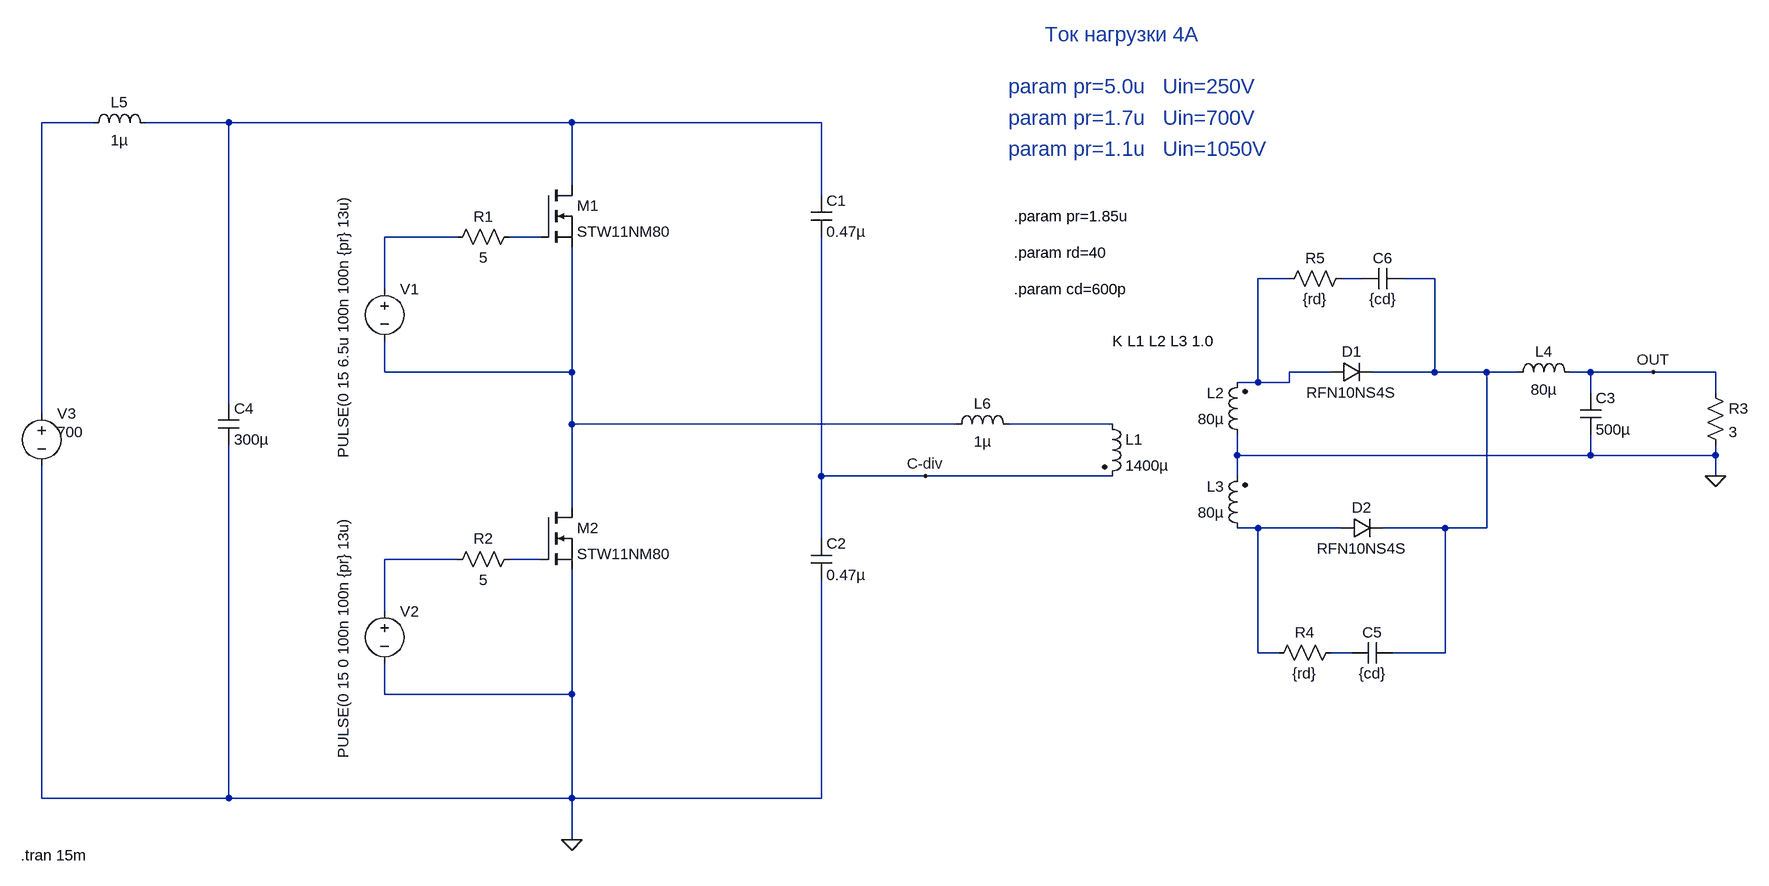
[diagram p0: schematic H-bridge-with-Inductor-and-dempfer.asc]
H-bridge-with-Inductor-and-dempfer.asc, the LTspice schematic file:
Version 4
SHEET 1 2120 1096
WIRE -432 -48 -512 -48
WIRE -224 -48 -352 -48
WIRE 304 -48 -224 -48
WIRE 688 -48 304 -48
WIRE 304 48 304 -48
WIRE 688 64 688 -48
WIRE 128 128 16 128
WIRE 256 128 208 128
WIRE 1408 192 1360 192
WIRE 1520 192 1488 192
WIRE 1632 192 1584 192
WIRE 16 208 16 128
WIRE 16 336 16 288
WIRE 304 336 304 144
WIRE 304 336 16 336
WIRE 1472 336 1408 336
WIRE 1632 336 1632 192
WIRE 1632 336 1536 336
WIRE 1712 336 1632 336
WIRE 1760 336 1712 336
WIRE 1872 336 1840 336
WIRE 1968 336 1872 336
WIRE 2064 336 1968 336
WIRE 1360 352 1360 192
WIRE 1360 352 1328 352
WIRE 1408 352 1408 336
WIRE 1408 352 1360 352
WIRE 1872 368 1872 336
WIRE 2064 368 2064 336
WIRE -224 384 -224 -48
WIRE -512 400 -512 -48
WIRE 304 416 304 336
WIRE 896 416 304 416
WIRE 1136 416 976 416
WIRE 1328 464 1328 432
WIRE 1872 464 1872 432
WIRE 1872 464 1328 464
WIRE 2064 464 2064 448
WIRE 2064 464 1872 464
WIRE 688 496 688 128
WIRE 848 496 688 496
WIRE 1136 496 848 496
WIRE 1328 496 1328 464
WIRE 2064 496 2064 464
WIRE 304 544 304 416
WIRE 1360 576 1328 576
WIRE 1488 576 1360 576
WIRE 1648 576 1552 576
WIRE 1712 576 1712 336
WIRE 1712 576 1648 576
WIRE 688 592 688 496
WIRE 128 624 16 624
WIRE 256 624 208 624
WIRE 16 704 16 624
WIRE 1360 768 1360 576
WIRE 1392 768 1360 768
WIRE 1504 768 1472 768
WIRE 1648 768 1648 576
WIRE 1648 768 1568 768
WIRE 16 832 16 784
WIRE 304 832 304 640
WIRE 304 832 16 832
WIRE -512 992 -512 480
WIRE -224 992 -224 448
WIRE -224 992 -512 992
WIRE 304 992 304 832
WIRE 304 992 -224 992
WIRE 688 992 688 656
WIRE 688 992 304 992
WIRE 304 1056 304 992
FLAG 304 1056 0
FLAG 2064 496 0
FLAG 1968 336 OUT
FLAG 848 496 C-div
SYMBOL nmos 256 48 R0
SYMATTR InstName M1
SYMATTR Value STW11NM80
SYMBOL nmos 256 544 R0
SYMATTR InstName M2
SYMATTR Value STW11NM80
SYMBOL voltage 16 192 R0
WINDOW 3 -64 -133 VRight 2
WINDOW 123 0 0 Left 0
WINDOW 39 0 0 Left 0
SYMATTR Value PULSE(0 15 6.5u 100n 100n {pr} 13u)
SYMATTR InstName V1
SYMBOL res 224 112 R90
WINDOW 0 0 56 VBottom 2
WINDOW 3 32 56 VTop 2
SYMATTR InstName R1
SYMATTR Value 5
SYMBOL res 224 608 R90
WINDOW 0 0 56 VBottom 2
WINDOW 3 32 56 VTop 2
SYMATTR InstName R2
SYMATTR Value 5
SYMBOL voltage 16 688 R0
WINDOW 3 -64 -133 VRight 2
WINDOW 123 0 0 Left 0
WINDOW 39 0 0 Left 0
SYMATTR Value PULSE(0 15 0 100n 100n {pr} 13u)
SYMATTR InstName V2
SYMBOL cap 672 64 R0
SYMATTR InstName C1
SYMATTR Value 0.47µ
SYMBOL voltage -512 384 R0
WINDOW 3 24 44 Left 2
WINDOW 123 0 0 Left 0
WINDOW 39 0 0 Left 0
SYMATTR Value 700
SYMATTR InstName V3
SYMBOL cap 672 592 R0
SYMATTR InstName C2
SYMATTR Value 0.47µ
SYMBOL ind2 1120 400 R0
SYMATTR InstName L1
SYMATTR Value 1400µ
SYMATTR Type ind
SYMBOL ind2 1344 448 R180
WINDOW 0 36 80 Left 2
WINDOW 3 36 40 Left 2
SYMATTR InstName L2
SYMATTR Value 80µ
SYMATTR Type ind
SYMBOL ind2 1344 592 R180
WINDOW 0 36 80 Left 2
WINDOW 3 36 40 Left 2
SYMATTR InstName L3
SYMATTR Value 80µ
SYMATTR Type ind
SYMBOL res 2048 352 R0
SYMATTR InstName R3
SYMATTR Value 3
SYMBOL ind 1744 352 R270
WINDOW 0 32 56 VTop 2
WINDOW 3 5 56 VBottom 2
SYMATTR InstName L4
SYMATTR Value 80µ
SYMBOL cap 1856 368 R0
SYMATTR InstName C3
SYMATTR Value 500µ
SYMBOL ind -448 -32 R270
WINDOW 0 32 56 VTop 2
WINDOW 3 5 56 VBottom 2
SYMATTR InstName L5
SYMATTR Value 1µ
SYMBOL cap -240 384 R0
SYMATTR InstName C4
SYMATTR Value 300µ
SYMBOL diode 1488 592 R270
WINDOW 0 32 32 VTop 2
WINDOW 3 0 32 VBottom 2
SYMATTR InstName D2
SYMATTR Value RFN10NS4S
SYMBOL diode 1472 352 R270
WINDOW 0 32 32 VTop 2
WINDOW 3 0 32 VBottom 2
SYMATTR InstName D1
SYMATTR Value RFN10NS4S
SYMBOL res 1488 752 R90
WINDOW 0 0 56 VBottom 2
WINDOW 3 32 56 VTop 2
SYMATTR InstName R4
SYMATTR Value {rd}
SYMBOL cap 1568 752 R90
WINDOW 0 0 32 VBottom 2
WINDOW 3 32 32 VTop 2
SYMATTR InstName C5
SYMATTR Value {cd}
SYMBOL res 1504 176 R90
WINDOW 0 0 56 VBottom 2
WINDOW 3 32 56 VTop 2
SYMATTR InstName R5
SYMATTR Value {rd}
SYMBOL cap 1584 176 R90
WINDOW 0 0 32 VBottom 2
WINDOW 3 32 32 VTop 2
SYMATTR InstName C6
SYMATTR Value {cd}
SYMBOL ind 880 432 R270
WINDOW 0 32 56 VTop 2
WINDOW 3 5 56 VBottom 2
SYMATTR InstName L6
SYMATTR Value 1µ
TEXT 1136 288 Left 2 !K L1 L2 L3 1.0
TEXT -544 1080 Left 2 !.tran 15m
TEXT 984 96 Left 2 !.param pr=1.85u
TEXT 976 -56 Left 3 ;param pr=1.7u   Uin=700V
TEXT 976 -8 Left 3 ;param pr=1.1u   Uin=1050V
TEXT 976 -104 Left 3 ;param pr=5.0u   Uin=250V
TEXT 1032 -184 Left 3 ;Ток нагрузки 4А
TEXT 984 152 Left 2 !.param rd=40
TEXT 984 208 Left 2 !.param cd=600p

The netlist it stands for:
* H-bridge-with-Inductor-and-dempfer.asc
M1 N002 N004 N008 N008 STW11NM80
M2 N008 N012 0 0 STW11NM80
V1 N003 N008 PULSE(0 15 6.5u 100n 100n {pr} 13u)
R1 N004 N003 5
R2 N012 N011 5
V2 N011 0 PULSE(0 15 0 100n 100n {pr} 13u)
C1 N002 C-div 0.47µ
V3 N001 0 700
C2 C-div 0 0.47µ
L1 N009 C-div 1400µ
L2 0 N005 80µ
L3 N010 0 80µ
R3 OUT 0 3
L4 N007 OUT 80µ
C3 OUT 0 500µ
L5 N001 N002 1µ
C4 N002 0 300µ
D2 N010 N007 RFN10NS4S
D1 N005 N007 RFN10NS4S
R4 N013 N010 {rd}
C5 N007 N013 {cd}
R5 N006 N005 {rd}
C6 N007 N006 {cd}
L6 N008 N009 1µ
.model D D
.lib standard.dio
.model NMOS NMOS
.model PMOS PMOS
.lib standard.mos
K L1 L2 L3 1.0
.tran 15m
.param pr=1.85u
* param pr=1.7u   Uin=700V
* param pr=1.1u   Uin=1050V
* param pr=5.0u   Uin=250V
* Ток нагрузки 4А
.param rd=40
.param cd=600p
.backanno
.end